# EAGLE design TMTD (EAGLE 5.06)
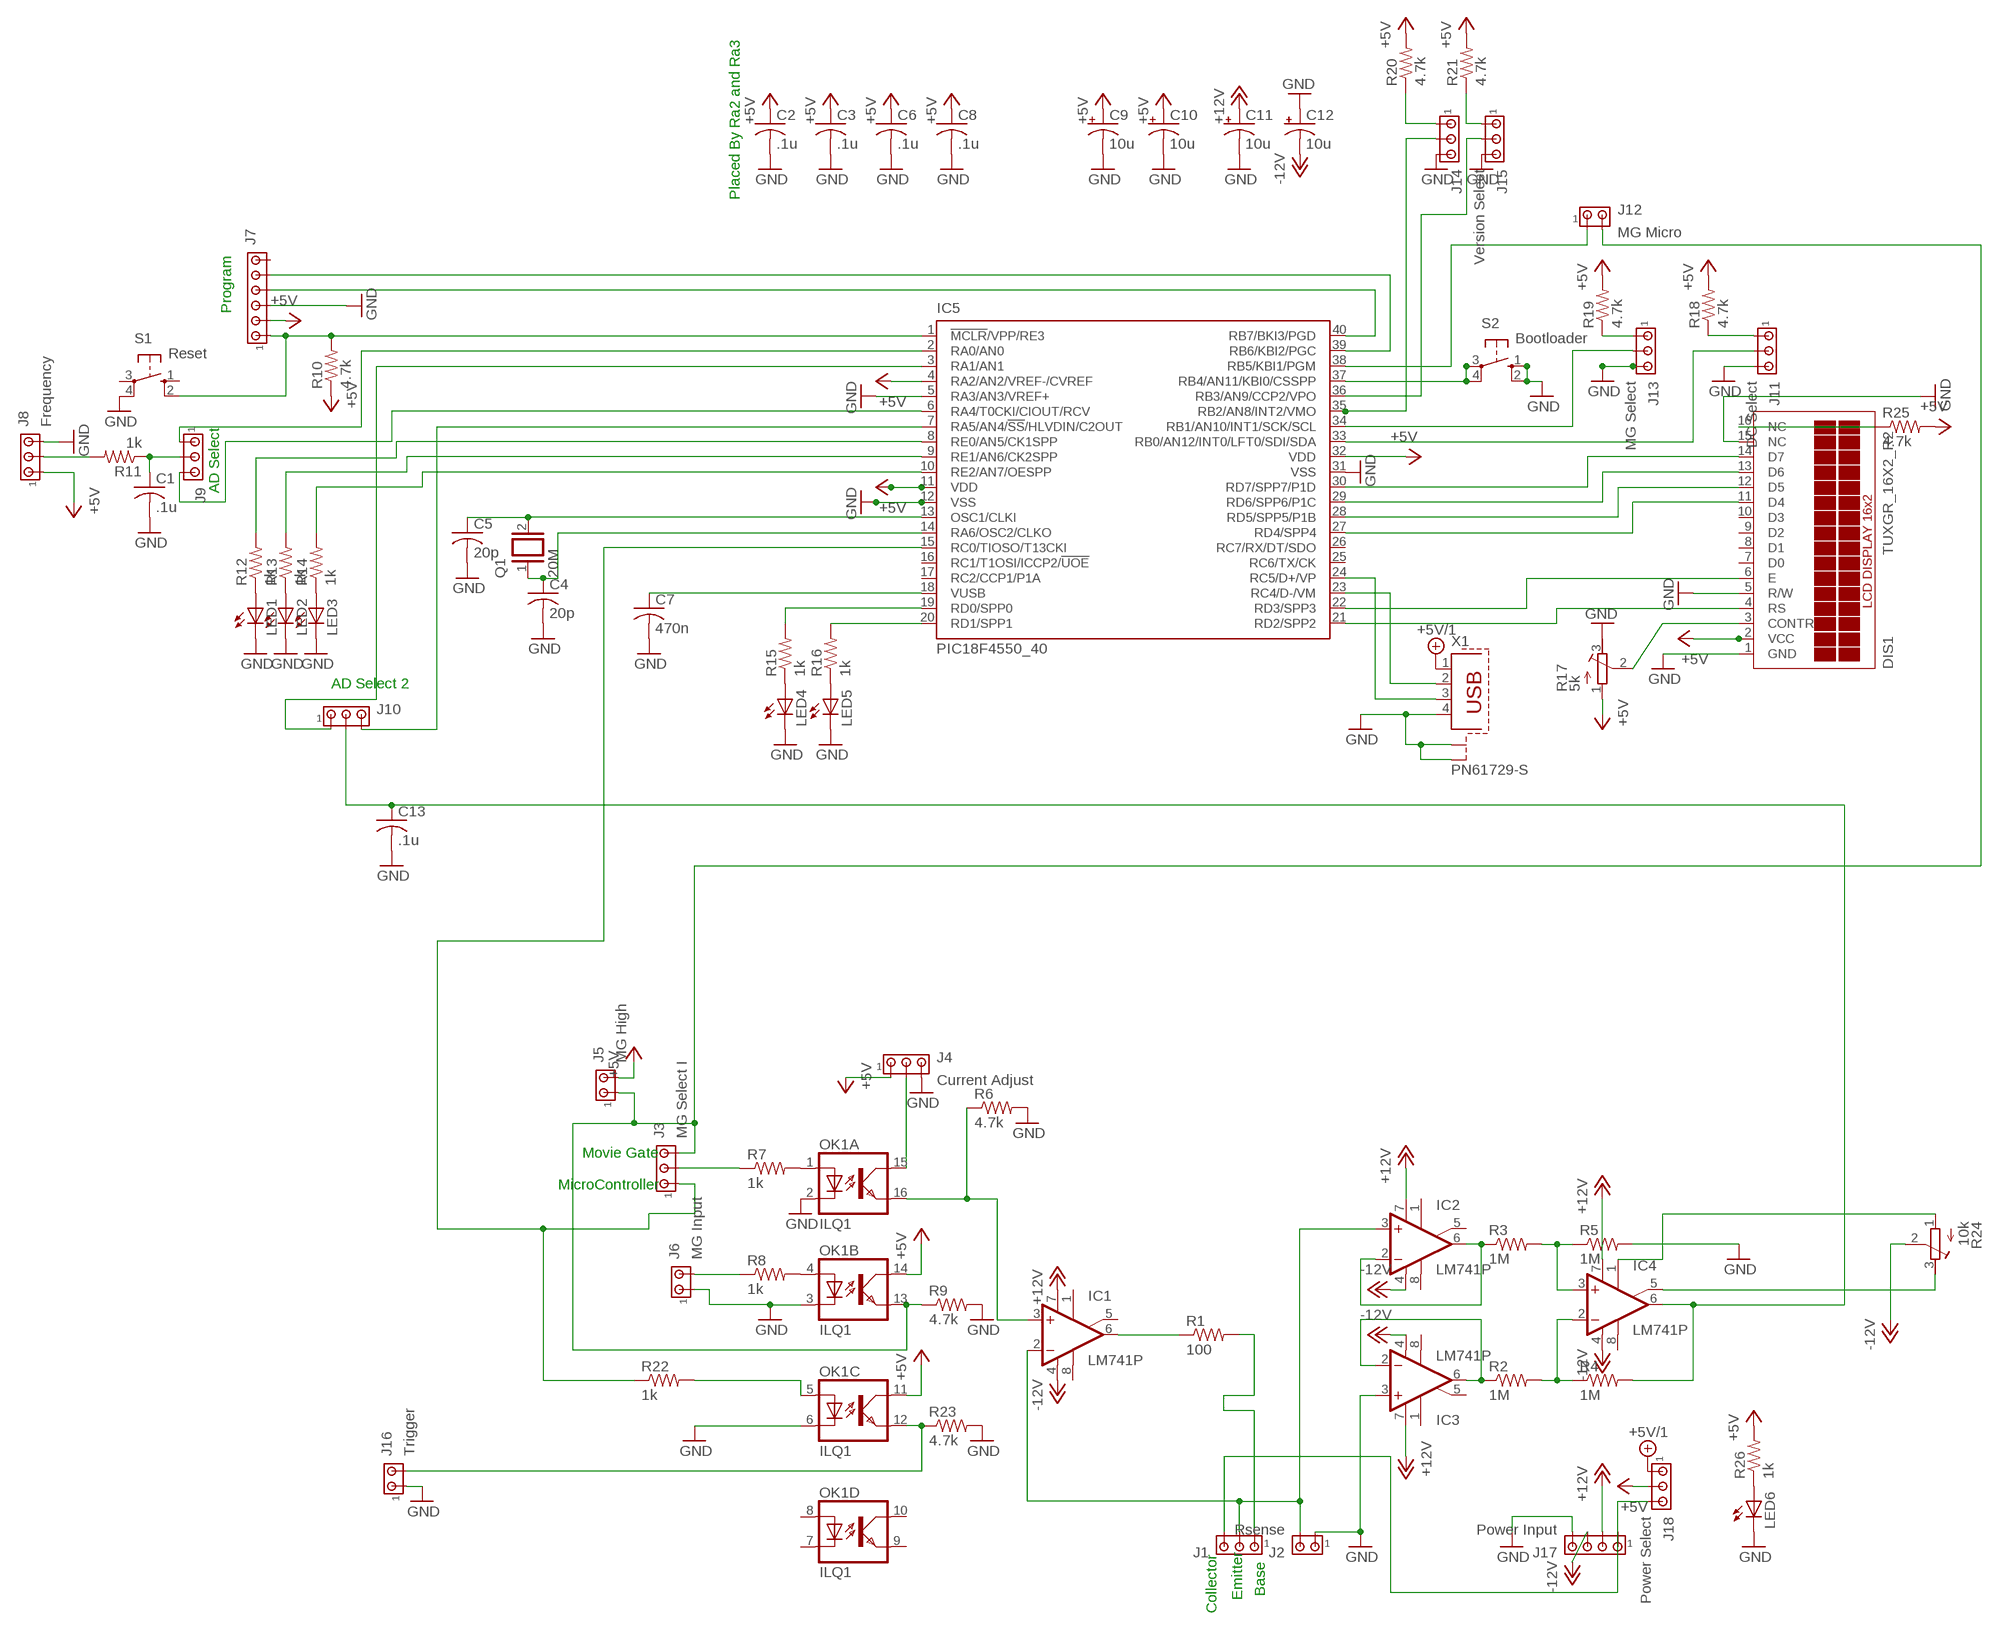
[diagram p0: schematic, sheet 1]

## Parts
C1  .1u  C-US025-030X050  [C025-030X050]
C2  .1u  C-US025-030X050  [C025-030X050]
C3  .1u  C-US025-030X050  [C025-030X050]
C4  20p  C-US050-030X075  [C050-030X075]
C5  20p  C-US050-030X075  [C050-030X075]
C6  .1u  C-US025-030X050  [C025-030X050]
C7  470n  C-US050-075X075  [C050-075X075]
C8  .1u  C-US025-030X050  [C025-030X050]
C9  10u  CPOL-USE2.5-6  [E2,5-6]
C10  10u  CPOL-USE2.5-6  [E2,5-6]
C11  10u  CPOL-USE2.5-6  [E2,5-6]
C12  10u  CPOL-USE2.5-6  [E2,5-6]
C13  .1u  C-US025-030X050  [C025-030X050]
DIS1  TUXGR_16X2_R2  [TUXGR_16X2_R2]
IC1  LM741P  [DIL08]
IC2  LM741P  [DIL08]
IC3  LM741P  [DIL08]
IC4  LM741P  [DIL08]
IC5  PIC18F4550_40  [DIL40]
J1  MTA03-156  [1X3MTA]
J2  Rsense  MTA02-156  [1X2MTA]
J3  MG Select I  MTA03-100  [10X03MTA]
J4  Current Adjust  MTA03-100  [10X03MTA]
J5  MG High  MTA02-100  [10X02MTA]
J6  MG Input  MTA02-100  [10X02MTA]
J7  MTA06-100  [10X06MTA]
J8  Frequency  MTA03-100  [10X03MTA]
J9  MTA03-100  [10X03MTA]
J10  MTA03-100  [10X03MTA]
J11  DC Select  MTA03-100  [10X03MTA]
J12  MG Micro  MTA02-100  [10X02MTA]
J13  MG Select  MTA03-100  [10X03MTA]
J14  MTA03-100  [10X03MTA]
J15  Version Select  MTA03-100  [10X03MTA]
J16  Trigger  MTA02-100  [10X02MTA]
J17  Power Input  MTA04-156  [1X4MTA]
J18  Power Select  MTA03-100  [10X03MTA]
LED1  LED3MM  [LED3MM]
LED2  LED3MM  [LED3MM]
LED3  LED3MM  [LED3MM]
LED4  LED3MM  [LED3MM]
LED5  LED3MM  [LED3MM]
LED6  LED3MM  [LED3MM]
OK1  ILQ1  [DIL16]
Q1  20M  XTAL/S  [QS]
R1  100  R-US_0204/7  [0204/7]
R2  1M  R-US_0204/7  [0204/7]
R3  1M  R-US_0204/7  [0204/7]
R4  1M  R-US_0204/7  [0204/7]
R5  1M  R-US_0204/7  [0204/7]
R6  4.7k  R-US_0204/7  [0204/7]
R7  1k  R-US_0204/7  [0204/7]
R8  1k  R-US_0204/7  [0204/7]
R9  4.7k  R-US_0204/7  [0204/7]
R10  4.7k  R-US_0204/7  [0204/7]
R11  1k  R-US_0204/7  [0204/7]
R12  1k  R-US_0204/7  [0204/7]
R13  1k  R-US_0204/7  [0204/7]
R14  1k  R-US_0204/7  [0204/7]
R15  1k  R-US_0204/7  [0204/7]
R16  1k  R-US_0204/7  [0204/7]
R17  5k  R-TRIMM3296W  [RTRIM3296W]
R18  4.7k  R-US_0204/7  [0204/7]
R19  4.7k  R-US_0204/7  [0204/7]
R20  4.7k  R-US_0204/7  [0204/7]
R21  4.7k  R-US_0204/7  [0204/7]
R22  1k  R-US_0204/7  [0204/7]
R23  4.7k  R-US_0204/7  [0204/7]
R24  10k  R-TRIMM3296W  [RTRIM3296W]
R25  4.7k  R-US_0204/7  [0204/7]
R26  1k  R-US_0204/7  [0204/7]
S1  Reset  10-XX  [B3F-10XX]
S2  Bootloader  10-XX  [B3F-10XX]
X1  PN61729-S  [PN61729-S]

## Nets
+5V: C2.1 C3.1 C6.1 C8.1 C9.+ C10.+ DIS1.2(VCC) IC5.4(RA2/AN2/VREF-/CVREF) IC5.11(VDD) IC5.32(VDD) J4.1 J5.2 J7.5 J8.1 J18.2 OK1.11(C:COL) OK1.14(B:COL) R10.1 R17.1(E) R18.2 R19.2 R20.2 R21.2 R25.2 R26.2
+5V/1: J18.1 X1.1
+12V: C11.+ IC1.7(V+) IC2.7(V+) IC3.7(V+) IC4.7(V+) J17.2
-12V: C12.- IC1.4(V-) IC2.4(V-) IC3.4(V-) IC4.4(V-) J17.3 R24.2(S)
GND: C1.2 C2.2 C3.2 C4.2 C5.2 C6.2 C7.2 C8.2 C9.- C10.- C11.- C12.+ C13.2 DIS1.1(GND) DIS1.5(R/W) DIS1.15(NC) IC3.3(+IN) IC5.5(RA3/AN3/VREF+) IC5.12(VSS) IC5.31(VSS) J2.1 J4.3 J6.1 J7.4 J8.3 J11.3 J13.3 J14.3 J15.3 J16.1 J17.4 LED1.K(C) LED2.K(C) LED3.K(C) LED4.K(C) LED5.K(C) LED6.K(C) OK1.2(A:C) OK1.3(B:C) OK1.6(C:C) R5.2 R6.2 R9.2 R17.3(A) R23.2 S1.4(P1) S2.1(S) S2.2(S1) X1.4 X1.S1 X1.S2
N$1: IC1.6(OUT) R1.1
N$2: J1.1 R1.2
N$3: IC1.2(-IN) IC2.3(+IN) J1.2 J2.2
N$4: IC3.2(-IN) IC3.6(OUT) R2.1
N$5: IC1.3(+IN) OK1.16(A:EMIT) R6.1
N$6: IC2.2(-IN) IC2.6(OUT) R3.1
N$7: IC4.3(+IN) R3.2 R5.1
N$8: IC4.2(-IN) R2.2 R4.1
N$9: C13.1 IC4.6(OUT) J10.2 R4.2
N$10: J4.2 OK1.15(A:COL)
N$11: OK1.1(A:A) R7.2
N$12: J3.2 R7.1
N$13: IC5.15(RC0/TIOSO/T13CKI) J3.1 R22.1
N$14: OK1.4(B:A) R8.2
N$15: J3.3 J5.1 J12.2 OK1.13(B:EMIT) R9.1
N$16: IC5.1(!MCLR!/VPP/RE3) J7.6 R10.2 S1.2(S1)
N$17: J6.2 R8.1
N$18: IC5.40(RB7/BKI3/PGD) J7.3
N$19: IC5.39(RB6/KBI2/PGC) J7.2
N$20: J8.2 R11.2
N$21: C1.1 J9.2 R11.1
N$22: IC5.2(RA0/AN0) J9.1
N$23: IC5.6(RA4/T0CKI/CIOUT/RCV) J9.3
N$24: IC5.3(RA1/AN1) J10.1
N$25: IC5.7(RA5/AN4/!SS!/HLVDIN/C2OUT) J10.3
N$26: LED1.A R12.1
N$27: LED2.A R13.1
N$28: LED3.A R14.1
N$29: IC5.8(RE0/AN5/CK1SPP) R12.2
N$30: IC5.9(RE1/AN6/CK2SPP) R13.2
N$31: IC5.10(RE2/AN7/OESPP) R14.2
N$32: C5.1 IC5.13(OSC1/CLKI) Q1.2
N$33: C4.1 IC5.14(RA6/OSC2/CLKO) Q1.1
N$34: C7.1 IC5.18(VUSB)
N$35: IC5.19(RD0/SPP0) R15.2
N$36: IC5.20(RD1/SPP1) R16.2
N$37: LED4.A R15.1
N$38: LED5.A R16.1
N$39: IC5.37(RB4/AN11/KBI0/CSSPP) S2.3(P) S2.4(P1)
N$40: DIS1.3(CONTR) R17.2(S)
N$41: DIS1.4(RS) IC5.21(RD2/SPP2)
N$42: DIS1.6(E) IC5.22(RD3/SPP3)
N$43: DIS1.11(D4) IC5.27(RD4/SPP4)
N$44: DIS1.12(D5) IC5.28(RD5/SPP5/P1B)
N$45: DIS1.13(D6) IC5.29(RD6/SPP6/P1C)
N$46: DIS1.14(D7) IC5.30(RD7/SPP7/P1D)
N$47: IC5.33(RB0/AN12/INT0/LFT0/SDI/SDA) J11.2
N$48: J11.1 R18.1
N$49: IC5.38(RB5/KBI1/PGM) J12.1
N$50: J15.1 R21.1
N$51: J13.1 R19.1
N$52: IC5.34(RB1/AN10/INT1/SCK/SCL) J13.2
N$53: IC5.35(RB2/AN8/INT2/VMO) J14.2
N$54: IC5.36(RB3/AN9/CCP2/VPO) J15.2
N$55: J14.1 R20.1
N$56: IC5.24(RC5/D+/VP) X1.3
N$57: IC5.23(RC4/D-/VM) X1.2
N$59: OK1.5(C:A) R22.2
N$60: J16.2 OK1.12(C:EMIT) R23.1
N$61: IC4.1(ON1) R24.1(E)
N$62: IC4.5(ON2) R24.3(A)
N$63: LED6.A R26.1
N$64: DIS1.16(NC) R25.1
N$65: J1.3 J17.1 J18.3
Unconnected: DIS1.7(D0) DIS1.8(D1) DIS1.9(D2) DIS1.10(D3) IC1.1(ON1) IC1.5(ON2) IC1.8(OPT) IC2.1(ON1) IC2.5(ON2) IC2.8(OPT) IC3.1(ON1) IC3.5(ON2) IC3.8(OPT) IC4.8(OPT) IC5.16(RC1/T1OSI/ICCP2/!UOE) IC5.17(RC2/CCP1/P1A) IC5.25(RC6/TX/CK) IC5.26(RC7/RX/DT/SDO) J7.1 OK1.7(D:C) OK1.8(D:A) OK1.9(D:EMIT) OK1.10(D:COL) S1.1(S) S1.3(P)

## Notes on the sheet
- Placed By Ra2 and Ra3
- Program
- AD Select
- AD Select 2
- Movie Gate
- MicroController
- Base
- Emitter
- Collector

## Library data of the parts
C1-C8 C13 = rcl:C-US: CAPACITOR, American symbol
C9-C12 = rcl:CPOL-US: POLARIZED CAPACITOR, American symbol
DIS1 = display-lcd:TUXGR_16X2_R2: Tuxgraphics LCD display 16x2 characters reflective, without background light Source: tuxgr_12x2_r2.pdf
IC1-IC4 = linear:*741: OP AMP
IC5 = microchip:PIC18F4*_40: USB Microcontrollers with nanoWatt Technology High-Performance, Enhanced Flash, 28/40/44-Pin, Source: http://ww1.microchip.com/downloads/en/devicedoc/39632c.pdf
J1 = con-amp:MTA03-156: AMP connector
J2 = con-amp:MTA02-156: AMP connector
J3 J4 J8-J11 J13-J15 J18 = con-amp:MTA03-100: AMP connector
J5 J6 J12 J16 = con-amp:MTA02-100: AMP connector
J7 = con-amp:MTA06-100: AMP connector
J17 = con-amp:MTA04-156: AMP connector
LED1-LED6 = led:LED: LED OSRAM: - CHIPLED LG R971, LG N971, LY N971, LG Q971, LY Q971, LO R971, LY R971 LH N974, LH R974 LS Q976, LO Q976, LY Q976 LO Q996 - Hyper CHIPLED LW Q18S LB Q993, LB Q99A, LB R99A - SideLED LS A670, LO A670, LY A670, LG A670, LP A670 LB A673, LV A673, LT A673, LW A673 LH A674 LY A675 LS A676, LA A676, LO A676, LY A676, LW A676 LS A679, LY A679, LG A679 - Hyper Micro SIDELED® LS Y876, LA Y876, LO Y876, LY Y876 LT Y87S - SmartLED LW L88C, LW L88S LB L89C, LB L89S, LG L890 LS L89K, LO L89K, LY L89K LS L896, LA L896, LO L896, LY L896 - TOPLED LS T670, LO T670, LY T670, LG T670, LP T670 LSG T670, LSP T670, LSY T670, LOP T670, LYG T670 LG T671, LOG T671, LSG T671 LB T673, LV T673, LT T673, LW T673 LH T674 LS T676, LA T676, LO T676, LY T676, LB T676, LH T676, LSB T676, LW T676 LB T67C, LV T67C, LT T67C, LS T67K, LO T67K, LY T67K, LW E67C LS E67B, LA E67B, LO E67B, LY E67B, LB E67C, LV E67C, LT E67C LW T67C LS T679, LY T679, LG T679 LS T770, LO T770, LY T770, LG T770, LP T770 LB T773, LV T773, LT T773, LW T773 LH T774 LS E675, LA E675, LY E675, LS T675 LS T776, LA T776, LO T776, LY T776, LB T776 LHGB T686 LT T68C, LB T68C - Hyper Mini TOPLED® LB M676 - Mini TOPLED Santana® LG M470 LS M47K, LO M47K, LY M47K Source: http://www.osram.convergy.de LUXEON: - LUMILED® LXK2-PW12-R00, LXK2-PW12-S00, LXK2-PW14-U00, LXK2-PW14-V00 LXK2-PM12-R00, LXK2-PM12-S00, LXK2-PM14-U00 LXK2-PE12-Q00, LXK2-PE12-R00, LXK2-PE12-S00, LXK2-PE14-T00, LXK2-PE14-U00 LXK2-PB12-K00, LXK2-PB12-L00, LXK2-PB12-M00, LXK2-PB14-N00, LXK2-PB14-P00, LXK2-PB14-Q00 LXK2-PR12-L00, LXK2-PR12-M00, LXK2-PR14-Q00, LXK2-PR14-R00 LXK2-PD12-Q00, LXK2-PD12-R00, LXK2-PD12-S00 LXK2-PH12-R00, LXK2-PH12-S00 LXK2-PL12-P00, LXK2-PL12-Q00, LXK2-PL12-R00 Source: www.luxeon.com KINGBRIGHT: KA-3528ASYC Source: www.kingbright.com
OK1 = optocoupler:ILQ1: SIEMENS OPTO COUPLER
Q1 = special:XTAL/S: CRYSTAL
R1-R16 R18-R23 R25 R26 = rcl:R-US_: RESISTOR, American symbol
R17 R24 = rcl:R-TRIMM: Trimm resistor
S1 S2 = switch-omron:10-XX: OMRON SWITCH
X1 = con-berg:PN61729-S: BERG USB connector

## Board
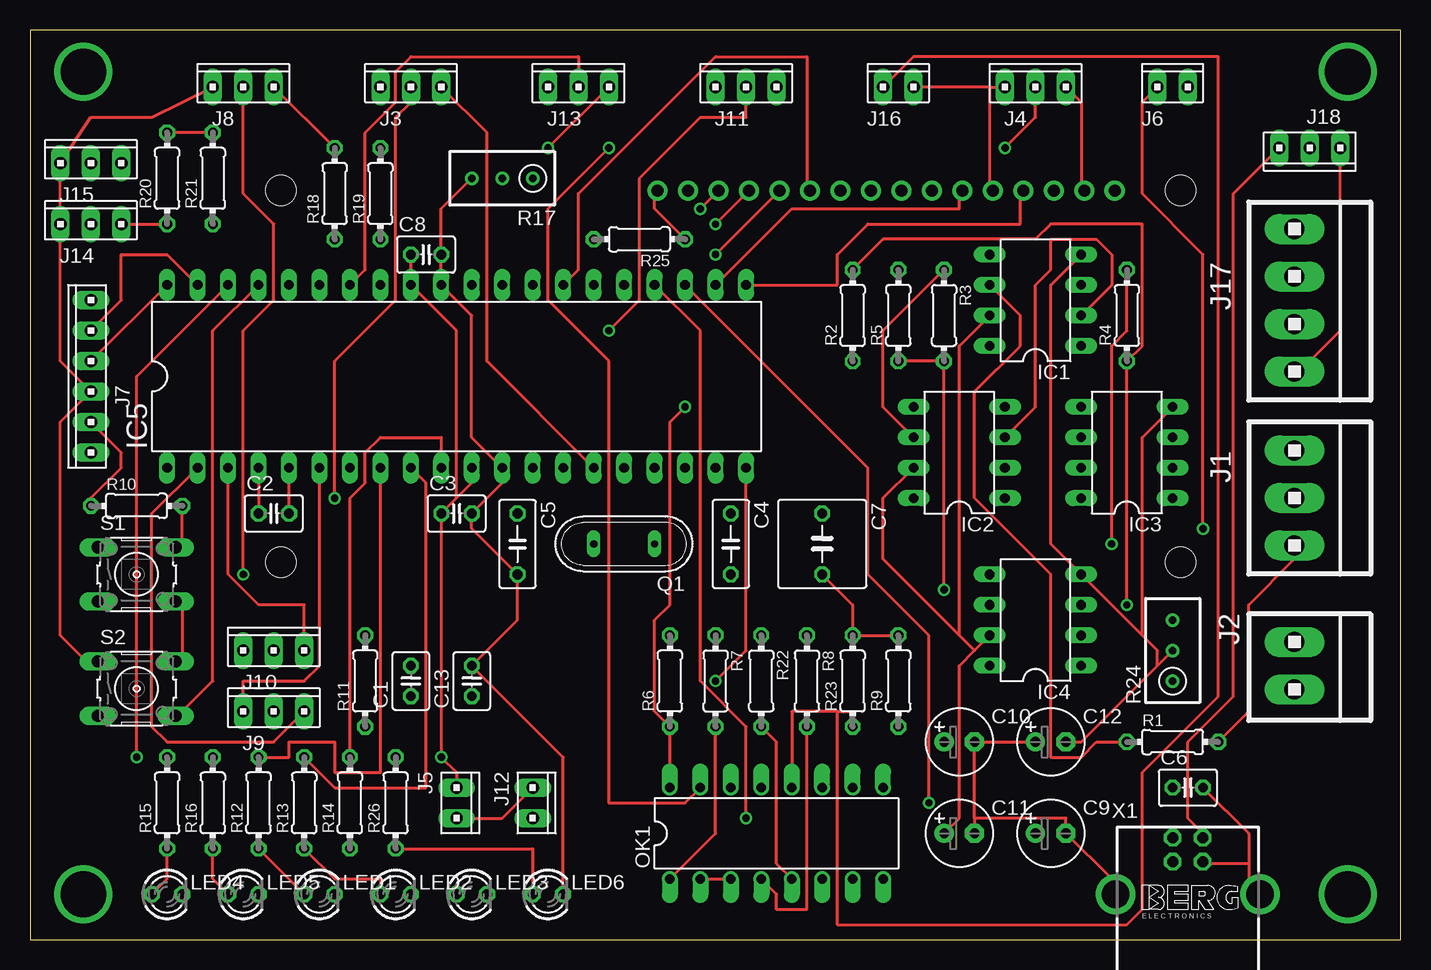
[diagram p1: board, top side]
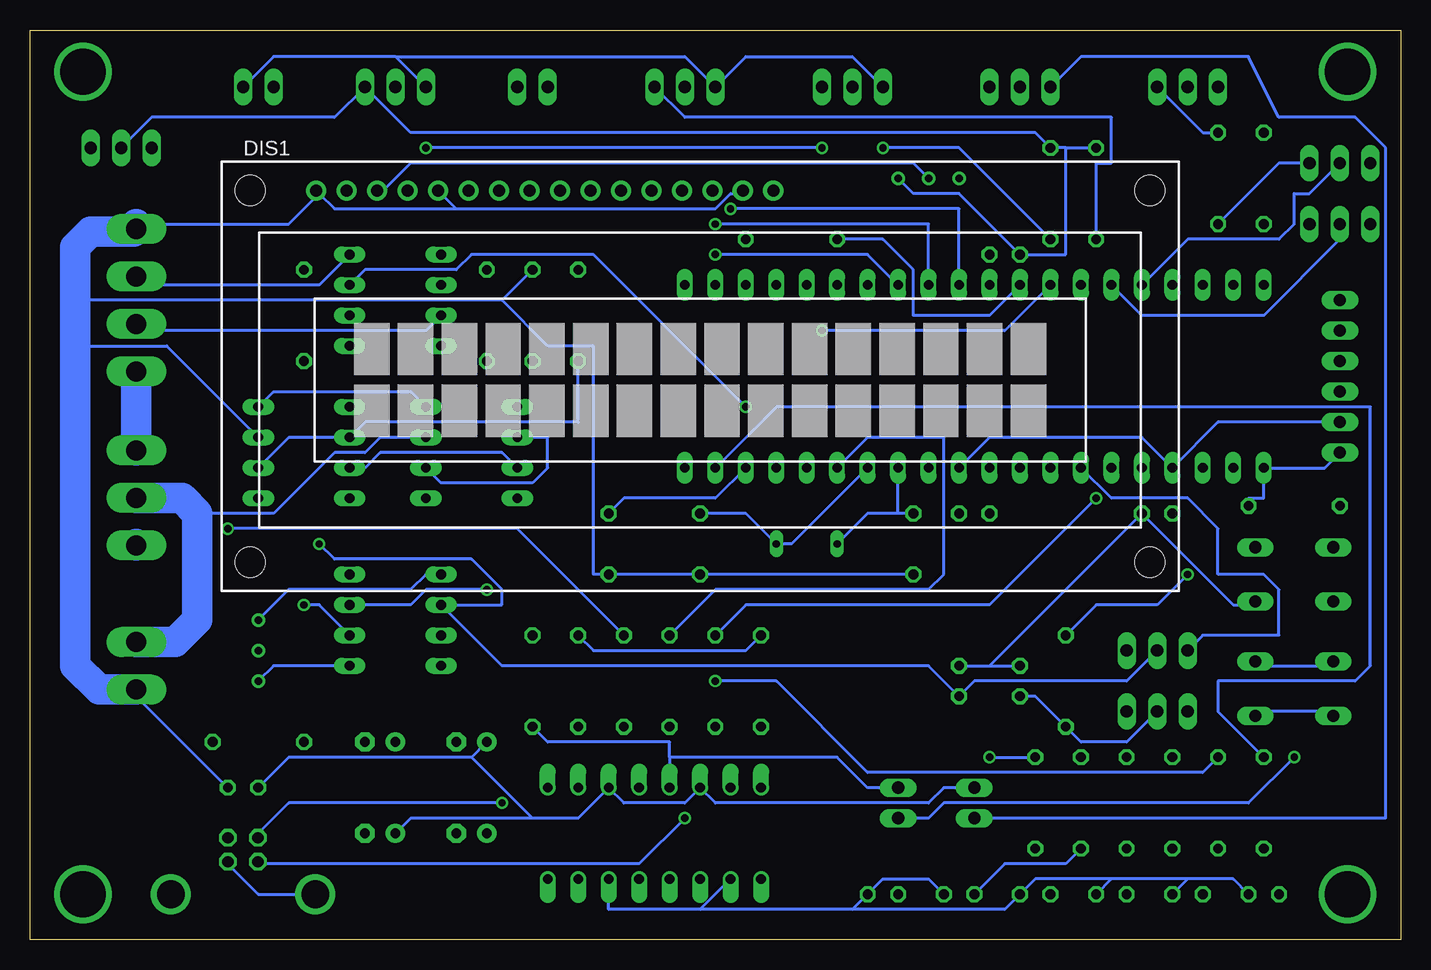
[diagram p2: board, bottom side, seen from below]

Size 114.28 x 75.87 mm. Coordinates in mm from the lower left corner, seen from the top.
Outline: 0,0 114.28,0 114.28,75.87 0,75.87 0,0
Copper layers (1*16): Top 0.035mm / dielectric 1.5mm / Bottom 0.035mm
Design rules "default": minimum track width 10mil, minimum drill 24mil, track to track 8mil, track to pad 8mil, pad to pad 8mil, via to via 8mil, smd to smd 8mil, copper to edge 40mil, drill to drill 8mil, minimum pad ring 10mil, minimum via ring 8mil, stop-mask expansion 4mil, vias tented up to drill 0mil, thermal gap 10mil

### Footprints (pad centres in the part's own frame; a part is rotated, then mirrored left to right if it is on the bottom)
C025-030X050 = drill 0.813 octagon: 1 -1.27,0; 2 1.27,0
C050-030X075 = drill 0.813 octagon: 1 -2.54,0; 2 2.54,0
C050-075X075 = drill 0.813 octagon: 1 -2.54,0; 2 2.54,0
E2,5-6 = drill 0.813 pad 1.6 round: + -1.27,0 | drill 0.813 pad 1.6 octagon: - 1.27,0
TUXGR_16X2_R2 = drill 1 pad 1.676 round: 1 -32,15.5; 2 -29.46,15.5; 3 -26.92,15.5; 4 -24.38,15.5; 5 -21.84,15.5; 6 -19.3,15.5; 7 -16.76,15.5; 8 -14.22,15.5; 9 -11.68,15.5; 10 -9.14,15.5; 11 -6.6,15.5; 12 -4.06,15.5; 13 -1.52,15.5; 14 1.02,15.5; 15 3.56,15.5; 16 6.1,15.5 | hole 2.5: -37.5,-15.5; 37.5,-15.5; -37.5,15.5; 37.5,15.5
DIL08 = drill 0.813 long: 1 -3.81,-3.81; 2 -1.27,-3.81; 3 1.27,-3.81; 4 3.81,-3.81; 5 3.81,3.81; 6 1.27,3.81; 7 -1.27,3.81; 8 -3.81,3.81
DIL40 = drill 0.813 long: 1 -24.13,-7.62; 2 -21.59,-7.62; 3 -19.05,-7.62; 4 -16.51,-7.62; 5 -13.97,-7.62; 6 -11.43,-7.62; 7 -8.89,-7.62; 8 -6.35,-7.62; 9 -3.81,-7.62; 10 -1.27,-7.62; 11 1.27,-7.62; 12 3.81,-7.62; 13 6.35,-7.62; 14 8.89,-7.62; 15 11.43,-7.62; 16 13.97,-7.62; 17 16.51,-7.62; 18 19.05,-7.62; 19 21.59,-7.62; 20 24.13,-7.62; 21 24.13,7.62; 22 21.59,7.62; 23 19.05,7.62; 24 16.51,7.62; 25 13.97,7.62; 26 11.43,7.62; 27 8.89,7.62; 28 6.35,7.62; 29 3.81,7.62; 30 1.27,7.62; 31 -1.27,7.62; 32 -3.81,7.62; 33 -6.35,7.62; 34 -8.89,7.62; 35 -11.43,7.62; 36 -13.97,7.62; 37 -16.51,7.62; 38 -19.05,7.62; 39 -21.59,7.62; 40 -24.13,7.62
1X3MTA = drill 1.676 long: 1 3.937,0; 2 -0.025,0; 3 -3.988,0
1X2MTA = drill 1.676 long: 1 1.981,0; 2 -1.981,0
10X03MTA = drill 1.016 long: 1 2.54,0; 2 0,0; 3 -2.54,0
10X02MTA = drill 1.016 long: 1 1.27,0; 2 -1.27,0
10X06MTA = drill 1.016 long: 1 6.35,0; 2 3.81,0; 3 1.27,0; 4 -1.27,0; 5 -3.81,0; 6 -6.35,0
1X4MTA = drill 1.676 long: 1 5.944,0; 2 1.981,0; 3 -1.981,0; 4 -5.944,0
LED3MM = drill 0.813 octagon: A -1.27,0; K 1.27,0
DIL16 = drill 0.813 offset: 1 -8.89,-3.81; 2 -6.35,-3.81; 3 -3.81,-3.81; 4 -1.27,-3.81; 5 1.27,-3.81; 6 3.81,-3.81; 7 6.35,-3.81; 8 8.89,-3.81; 9 8.89,3.81; 10 6.35,3.81; 11 3.81,3.81; 12 1.27,3.81; 13 -1.27,3.81; 14 -3.81,3.81; 15 -6.35,3.81; 16 -8.89,3.81
QS = drill 0.61 long: 1 -2.54,0; 2 2.54,0
0204/7 = drill 0.813 octagon: 1 -3.81,0; 2 3.81,0
RTRIM3296W = drill 0.61 round: 1 0,-2.54; 2 0,0; 3 0,2.54
B3F-10XX = drill 1.016 long: 1 -3.251,2.261; 2 3.251,2.261; 3 -3.251,-2.261; 4 3.251,-2.261
PN61729-S = drill 0.95 octagon: 1 1.25,4.71; 2 -1.25,4.71; 3 -1.25,2.71; 4 1.25,2.71 | drill 2.3 pad 2.9 round: S1 -6.02,0; S2 6.02,0

### Placement (x,y rotation side)
C1  31.75,21.59 90 top
C2  20.32,35.56 0 top
C3  35.56,35.56 0 top
C4  58.42,33.02 270 top
C5  40.64,33.02 270 top
C6  96.52,12.7 0 top
C7  66.04,33.02 270 top
C8  33.02,57.15 0 top
C9  85.09,8.89 0 top
C10  77.47,16.51 0 top
C11  77.47,8.89 0 top
C12  85.09,16.51 0 top
C13  36.83,21.59 90 top
DIS1  58.42,46.99 0 bottom
IC1  83.82,53.34 90 top
IC2  77.47,40.64 90 top
IC3  91.44,40.64 90 top
IC4  83.82,26.67 90 top
IC5  35.56,46.99 0 top
J1  105.41,36.83 270 top
J2  105.41,22.86 270 top
J3  31.75,71.12 0 top
J4  83.82,71.12 0 top
J5  35.56,11.43 270 top
J6  95.25,71.12 0 top
J7  5.08,46.99 90 top
J8  17.78,71.12 0 top
J9  20.32,19.05 0 top
J10  20.32,24.13 0 top
J11  59.69,71.12 0 top
J12  41.91,11.43 270 top
J13  45.72,71.12 0 top
J14  5.08,59.69 0 top
J15  5.08,64.77 0 top
J16  72.39,71.12 0 top
J17  105.41,53.34 270 top
J18  106.68,66.04 180 top
LED1  24.13,3.81 0 top
LED2  30.48,3.81 0 top
LED3  36.83,3.81 0 top
LED4  11.43,3.81 0 top
LED5  17.78,3.81 0 top
LED6  43.18,3.81 0 top
OK1  62.23,8.89 0 top
Q1  49.53,33.02 180 top
R1  95.25,16.51 0 top
R2  68.58,52.07 90 top
R3  76.2,52.07 270 top
R4  91.44,52.07 90 top
R5  72.39,52.07 90 top
R6  53.34,21.59 90 top
R7  57.15,21.59 270 top
R8  64.77,21.59 270 top
R9  72.39,21.59 90 top
R10  8.89,36.2 0 top
R11  27.94,21.59 90 top
R12  19.05,11.43 90 top
R13  22.86,11.43 90 top
R14  26.67,11.43 90 top
R15  11.43,11.43 90 top
R16  15.24,11.43 90 top
R17  39.37,63.5 90 top
R18  25.4,62.23 90 top
R19  29.21,62.23 90 top
R20  11.43,63.5 90 top
R21  15.24,63.5 90 top
R22  60.96,21.59 270 top
R23  68.58,21.59 90 top
R24  95.25,24.13 0 top
R25  50.8,58.42 180 top
R26  30.48,11.43 90 top
S1  8.89,30.48 0 top
S2  8.89,20.95 0 top
X1  96.52,3.81 0 top

### Tracks (layer width: path | path; a pad name or v marks a point on that pad's centre or on a via)
+5V  (via drill 0.61)
  Top 0.254: J4.1 87.63,69.85 87.63,62.23 DIS1.2 | R21.2 R20.2 | R18.2 J8.1 | C8.1 IC5.32 35.56,50.8 35.56,36.83 | IC5.4 C2.1 | J7.5 7.62,40.64 7.62,39.37 5.08,36.83 R10.1 | 35.56,36.83 36.83,38.1 IC5.11 | 35.56,36.83 C3.1 v34.29,15.24 35.56,13.97 J5.2
  Bottom 0.254: J18.2 104.14,68.58 88.9,68.58 J4.1 82.55,67.31 30.48,67.31 R19.2 27.94,66.04 | 27.94,66.04 R18.2 | J8.1 16.51,67.31 R21.2 | R17.1 40.64,62.23 36.83,62.23 C8.1 27.94,57.15 27.94,66.04 | R25.2 43.18,58.42 40.64,55.88 40.64,52.07 34.29,52.07 IC5.32 | C6.1 92.71,15.24 77.47,15.24 | 77.47,15.24 C10.+ | C9.+ 82.55,10.16 72.39,10.16 | 72.39,10.16 68.58,10.16 OK1.11 64.77,11.43 59.69,11.43 OK1.14 57.15,11.43 39.37,11.43 38.1,12.7 J5.2 | 72.39,10.16 77.47,15.24 | J7.5 15.24,43.18 IC5.4 21.59,41.91 34.29,41.91 IC5.11 | v34.29,15.24 R26.2
+5V/1
  Top 0.254: J18.1 100.33,62.23 100.33,20.32 96.52,16.51 96.52,10.16 97.79,8.89 X1.1
+12V
  Top 0.254: 78.74,24.13 77.47,22.86 77.47,10.16 C11.+ | 78.74,24.13 IC4.7 | IC2.7 71.12,36.83 71.12,31.75 77.47,25.4 | 78.74,24.13 77.47,25.4 | IC1.7 77.47,49.53 77.47,25.4
  Bottom 0.254: IC1.7 81.28,50.8 105.41,50.8 J17.2 | IC2.7 74.93,40.64 85.09,40.64 86.36,39.37 IC3.7
-12V
  Top 0.254: 93.98,22.86 87.63,16.51 C12.- | 93.98,22.86 R24.2 | 92.71,25.4 93.98,24.13 93.98,22.86 | 92.71,25.4 IC4.4 85.09,33.02 85.09,54.61 IC1.4 | IC3.4 92.71,41.91 92.71,25.4
  Bottom 0.254: IC1.4 90.17,54.61 105.41,54.61 J17.3 | IC2.4 82.55,45.72 93.98,45.72 IC3.4
GND
  Top 0.254: 80.01,71.12 J4.3 | 80.01,71.12 J16.1 | 80.01,71.12 80.01,62.23 DIS1.5 | C6.2 101.6,8.89 101.6,6.35 | 101.6,6.35 101.6,3.81 X1.S2 | 101.6,6.35 97.79,6.35 X1.4 | 78.74,10.16 C10.- C12.+ | 78.74,10.16 C11.- | X1.S1 90.17,3.81 90.17,5.08 C9.- 86.36,10.16 78.74,10.16 | OK1.2 OK1.3 | J8.3 10.16,68.58 5.08,68.58 J15.3 J14.3 2.54,48.26 J7.4 2.54,43.18 2.54,25.4 5.08,22.86 S2.1 | C2.2 IC5.5 | S1.4 12.7,27.94 12.7,22.86 S2.2 | R9.2 R23.2 68.58,27.94 C7.2 | R17.3 34.29,60.96 C8.2 IC5.31 36.83,52.07 36.83,41.91 IC5.12 39.37,38.1 C3.2 36.83,34.29 C5.2 40.64,26.67 C13.2 44.45,15.24 LED6.K
  Bottom 0.254: 78.74,60.96 57.15,60.96 55.88,62.23 54.61,62.23 DIS1.15 | 78.74,60.96 80.01,62.23 DIS1.5 | 90.17,62.23 88.9,60.96 78.74,60.96 | J13.3 45.72,73.66 54.61,73.66 J11.3 59.69,73.66 83.82,73.66 | J6.1 93.98,73.66 83.82,73.66 | J4.3 83.82,73.66 | X1.4 97.79,6.35 95.25,3.81 X1.S1 | 74.93,53.34 R5.2 | 74.93,53.34 110.49,53.34 | IC3.3 102.87,49.53 110.49,49.53 | C6.2 105.41,20.32 J2.1 | 90.17,62.23 92.71,59.69 105.41,59.69 | 90.17,62.23 DIS1.1 | LED4.K 13.97,5.08 17.78,5.08 | 17.78,5.08 LED5.K | 24.13,5.08 LED1.K | 17.78,5.08 24.13,5.08 | 24.13,5.08 30.48,5.08 LED2.K 33.02,2.54 45.72,2.54 | LED3.K 39.37,5.08 43.18,5.08 LED6.K 45.72,2.54 | OK1.6 66.04,2.54 58.42,2.54 | 58.42,2.54 OK1.2 | 45.72,2.54 58.42,2.54 | S2.1 6.35,22.86 11.43,22.86 S2.2 | S1.4 12.7,27.94 13.97,27.94 C2.2 34.29,22.86 | R6.2 54.61,24.13 67.31,24.13 R23.2 | C13.2 34.29,22.86 | 34.29,22.86 C1.2 | C5.2 C4.2 C7.2 67.31,30.48 67.31,49.53 71.12,49.53 74.93,53.34
  Bottom 2.54: 105.41,59.69 J17.4 105.64,59.05 109.22,59.05 110.49,57.78 110.49,53.34 110.49,49.53 110.49,22.86 108.51,20.88 J2.1
N$1
  Top 0.254: R1.1 88.9,16.51 87.63,15.24 85.09,15.24 85.09,30.48 78.74,36.83 78.74,45.72 82.55,49.53 82.55,52.07 IC1.6
N$2
  Top 0.254: R1.2 101.6,19.05 101.6,27.94 105.41,31.75 J1.1
  Bottom 2.54: J1.1 105.41,33.02
N$3
  Top 0.254: IC1.2 90.17,54.61 90.17,57.15 88.9,58.42 85.09,58.42 85.09,55.88 83.82,54.61 83.82,44.45 IC2.3
  Bottom 0.254: IC2.3 85.09,41.91 86.36,40.64 88.9,40.64 93.98,35.56 100.33,35.56
  Bottom 2.54: J2.2 102.16,24.84 100.33,26.67 100.33,35.56 101.6,36.83 105.39,36.83 J1.2
N$4
  Bottom 0.254: R2.1 68.58,43.18 86.36,43.18 IC3.6 92.71,41.91 IC3.2
N$5  (via drill 0.61)
  Top 0.254: OK1.16 R6.1 52.07,19.05 52.07,26.67 53.34,27.94 53.34,43.18 v54.61,44.45
  Bottom 0.254: IC1.3 86.36,55.88 78.74,55.88 77.47,57.15 67.31,57.15 v54.61,44.45
N$6
  Top 0.254: IC2.6 71.12,44.45 71.12,50.8 R3.1
  Bottom 0.254: IC2.2 80.01,38.1 72.39,38.1 71.12,39.37 71.12,41.91 IC2.6
N$7  (via drill 0.61)
  Top 0.254: R5.1 R3.2 v76.2,29.21
  Bottom 0.254: IC4.3 82.55,27.94 81.28,29.21 v76.2,29.21
N$8  (via drill 0.61)
  Top 0.254: v91.44,27.94 R4.1 92.71,49.53 92.71,59.69 85.09,59.69 83.82,58.42 71.12,58.42 R2.2
  Bottom 0.254: IC4.2 90.17,27.94 v91.44,27.94
N$9  (via drill 0.61)
  Top 0.254: R4.2 91.44,50.8 90.17,49.53 v90.17,33.02
  Bottom 0.254: J10.2 22.86,21.59 35.56,21.59 C13.1 39.37,22.86 74.93,22.86 IC4.6 74.93,27.94 74.93,29.21 77.47,31.75 88.9,31.75 v90.17,33.02
N$10  (via drill 0.61)
  Top 0.254: OK1.15 54.61,11.43 48.26,11.43 48.26,48.26 43.18,53.34 43.18,60.96 v48.26,66.04 | v81.28,66.04 83.82,68.58 J4.2
  Bottom 0.254: v48.26,66.04 v81.28,66.04
N$11
  Top 0.254: OK1.1 57.15,8.89 R7.2
N$12  (via drill 0.61)
  Top 0.254: v25.4,36.83 25.4,48.26 30.48,53.34 30.48,68.58 31.75,69.85 J3.2
  Bottom 0.254: R7.1 54.61,27.94 34.29,27.94 v25.4,36.83
N$13
  Top 0.254: IC5.15 38.1,48.26 38.1,67.31 J3.1
  Bottom 0.254: R22.1 57.15,29.21 39.37,29.21 38.1,30.48 38.1,41.91 44.45,41.91 IC5.15
N$14
  Top 0.254: OK1.4 62.23,3.81 62.23,2.54 64.77,2.54 R8.2
N$15
  Top 0.254: J5.1 39.37,10.16 J12.2
  Bottom 0.254: 60.96,15.24 60.96,16.51 71.12,16.51 R9.1 | 60.96,15.24 OK1.13 | J3.3 26.67,73.66 12.7,73.66 10.16,68.58 3.81,68.58 1.27,66.04 1.27,10.16 J5.1 | 60.96,15.24 46.99,15.24 44.45,12.7 J12.2
N$16
  Top 0.254: R10.2 12.7,33.02 S1.2
  Bottom 0.254: R10.2 12.7,36.83 11.43,36.83 IC5.1 6.35,39.37 J7.6
N$17  (via drill 0.61)
  Top 0.254: v97.79,34.29 97.79,57.15 92.71,62.23 92.71,69.85 J6.2
  Bottom 0.254: R8.1 73.66,34.29 v97.79,34.29
N$18
  Top 0.254: J7.3 IC5.40
N$19
  Top 0.254: IC5.39 11.43,57.15 7.62,57.15 7.62,53.34 J7.2
N$20  (via drill 0.61)
  Top 0.254: v17.78,30.48 17.78,50.8 20.32,53.34 20.32,59.69 17.78,62.23 J8.2
  Bottom 0.254: R11.2 25.4,27.94 20.32,27.94 v17.78,30.48
N$21
  Bottom 0.254: C1.1 30.48,20.32 R11.1 26.67,16.51 22.86,16.51 J9.2
N$22
  Top 0.254: IC5.2 10.16,35.56 10.16,17.78 11.43,16.51 20.32,16.51 J9.1
N$23
  Top 0.254: IC5.6 24.13,22.86 22.86,21.59 17.78,21.59 J9.3
N$24
  Top 0.254: IC5.3 16.51,30.48 19.05,27.94 22.86,27.94 J10.1
N$25
  Bottom 0.254: IC5.7 24.13,36.83 17.78,36.83 15.24,34.29 15.24,30.48 11.43,30.48 10.16,29.21 10.16,25.4 16.51,25.4 J10.3
N$26
  Top 0.254: R12.1 LED1.A
N$27
  Top 0.254: R13.1 25.4,5.08 29.21,5.08 LED2.A
N$28
  Bottom 0.254: R14.1 27.94,6.35 33.02,6.35 LED3.A
N$29
  Top 0.254: R12.2 21.59,15.24 21.59,16.51 25.4,16.51 25.4,13.97 29.21,13.97 IC5.8
N$30
  Top 0.254: R13.2 25.4,12.7 33.02,12.7 33.02,38.1 IC5.9
N$31
  Top 0.254: R14.2 26.67,36.83 27.94,38.1 27.94,40.64 29.21,41.91 34.29,41.91 IC5.10
N$32
  Bottom 0.254: Q1.2 44.45,35.56 41.91,35.56 | C5.1 41.91,35.56 | 41.91,35.56 IC5.13
N$33
  Bottom 0.254: C4.1 54.61,35.56 Q1.1 50.8,33.02 IC5.14
N$34
  Bottom 0.254: IC5.18 57.15,36.83 64.77,36.83 C7.1
N$35
  Bottom 0.254: R15.2 15.24,19.05 15.24,21.59 3.81,21.59 2.54,22.86 2.54,44.45 52.07,44.45 IC5.19
N$36  (via drill 0.61)
  Top 0.254: v57.15,21.59 59.69,24.13 IC5.20
  Bottom 0.254: R16.2 16.51,13.97 44.45,13.97 52.07,21.59 v57.15,21.59
N$37
  Top 0.254: LED4.A 11.43,5.08 R15.1
N$38
  Top 0.254: LED5.A 15.24,5.08 R16.1
N$39
  Top 0.254: IC5.37 15.24,50.8 15.24,21.59 12.7,19.05 S2.4
  Bottom 0.254: S2.3 6.35,19.05 11.43,19.05 S2.4
N$40
  Bottom 0.254: R17.2 40.64,64.77 82.55,64.77 85.09,62.23 DIS1.3
N$41
  Top 0.254: IC5.21 67.31,54.61 67.31,57.15 69.85,59.69 82.55,59.69 82.55,62.23 DIS1.4
N$42
  Top 0.254: IC5.22 63.5,60.96 77.47,60.96 77.47,62.23 DIS1.6
N$43
  Top 0.254: IC5.27 45.72,55.88 45.72,62.23 57.15,73.66 64.77,73.66 64.77,62.23 DIS1.11
N$44  (via drill 0.61)
  Top 0.254: v57.15,57.15 62.23,62.23 DIS1.12
  Bottom 0.254: IC5.28 44.45,57.15 v57.15,57.15
N$45  (via drill 0.61)
  Top 0.254: v57.15,59.69 59.69,62.23 DIS1.13
  Bottom 0.254: IC5.29 39.37,59.69 v57.15,59.69
N$46  (via drill 0.61)
  Top 0.254: v55.88,60.96 57.15,62.23 DIS1.14
  Bottom 0.254: IC5.30 36.83,60.96 v55.88,60.96
N$47  (via drill 0.61)
  Top 0.254: v48.26,50.8 50.8,53.34 50.8,63.5 55.88,68.58 59.69,68.58 J11.2
  Bottom 0.254: IC5.33 33.02,50.8 v48.26,50.8
N$48
  Bottom 0.254: R18.1 25.4,64.77 24.13,64.77 24.13,68.58 59.69,68.58 J11.1
N$49  (via drill 0.61)
  Top 0.254: IC5.38 8.89,46.99 v8.89,15.24
  Bottom 0.254: v8.89,15.24 12.7,11.43 38.1,11.43 39.37,10.16 J12.1
N$50
  Bottom 0.254: R21.1 10.16,64.77 J15.1
N$51  (via drill 0.61)
  Top 0.254: v43.18,66.04 J13.1
  Bottom 0.254: R19.1 36.83,66.04 v43.18,66.04
N$52
  Top 0.254: IC5.34 27.94,55.88 27.94,67.31 30.48,69.85 30.48,72.39 31.75,73.66 45.72,73.66 J13.2
N$53
  Bottom 0.254: IC5.35 21.59,52.07 11.43,52.07 5.08,58.42 J14.2
N$54
  Bottom 0.254: IC5.36 17.78,58.42 10.16,58.42 8.89,59.69 8.89,62.23 7.62,62.23 J15.2
N$55
  Top 0.254: J14.1 R20.1
N$56  (via drill 0.61)
  Top 0.254: IC5.24 55.88,50.8 55.88,21.59 59.69,17.78 v59.69,10.16
  Bottom 0.254: v59.69,10.16 63.5,6.35 95.25,6.35 X1.3
N$57  (via drill 0.61)
  Top 0.254: IC5.23 69.85,39.37 69.85,30.48 74.93,25.4 v74.93,11.43
  Bottom 0.254: v74.93,11.43 92.71,11.43 95.25,8.89 X1.2
N$58  (via drill 3.8)
  other vias: 4.45,3.81
N$59
  Top 0.254: OK1.5 62.23,6.35 62.23,16.51 R22.2
N$60
  Top 0.254: OK1.12 63.5,19.05 67.31,19.05 | 67.31,19.05 68.58,19.05 R23.1 | J16.2 73.66,73.66 99.06,73.66 99.06,20.32 92.71,13.97 92.71,2.54 91.44,1.27 67.31,1.27 67.31,19.05
N$61
  Bottom 0.254: R24.1 93.98,22.86 IC4.1
N$62
  Bottom 0.254: R24.3 92.71,29.21 82.55,29.21 81.28,30.48 IC4.5
N$63
  Top 0.254: R26.1 41.91,7.62 LED6.A
N$64
  Top 0.254: R25.1 52.07,60.96 52.07,62.23 DIS1.16
N$65
  Top 0.254: J18.3 109.22,50.8 105.41,46.99 J17.1
  Bottom 2.54: J1.3 J17.1
N$66  (via drill 3.8)
  other vias: 109.86,3.81
N$67  (via drill 3.8)
  other vias: 4.45,72.39
N$68  (via drill 3.8)
  other vias: 109.86,72.39